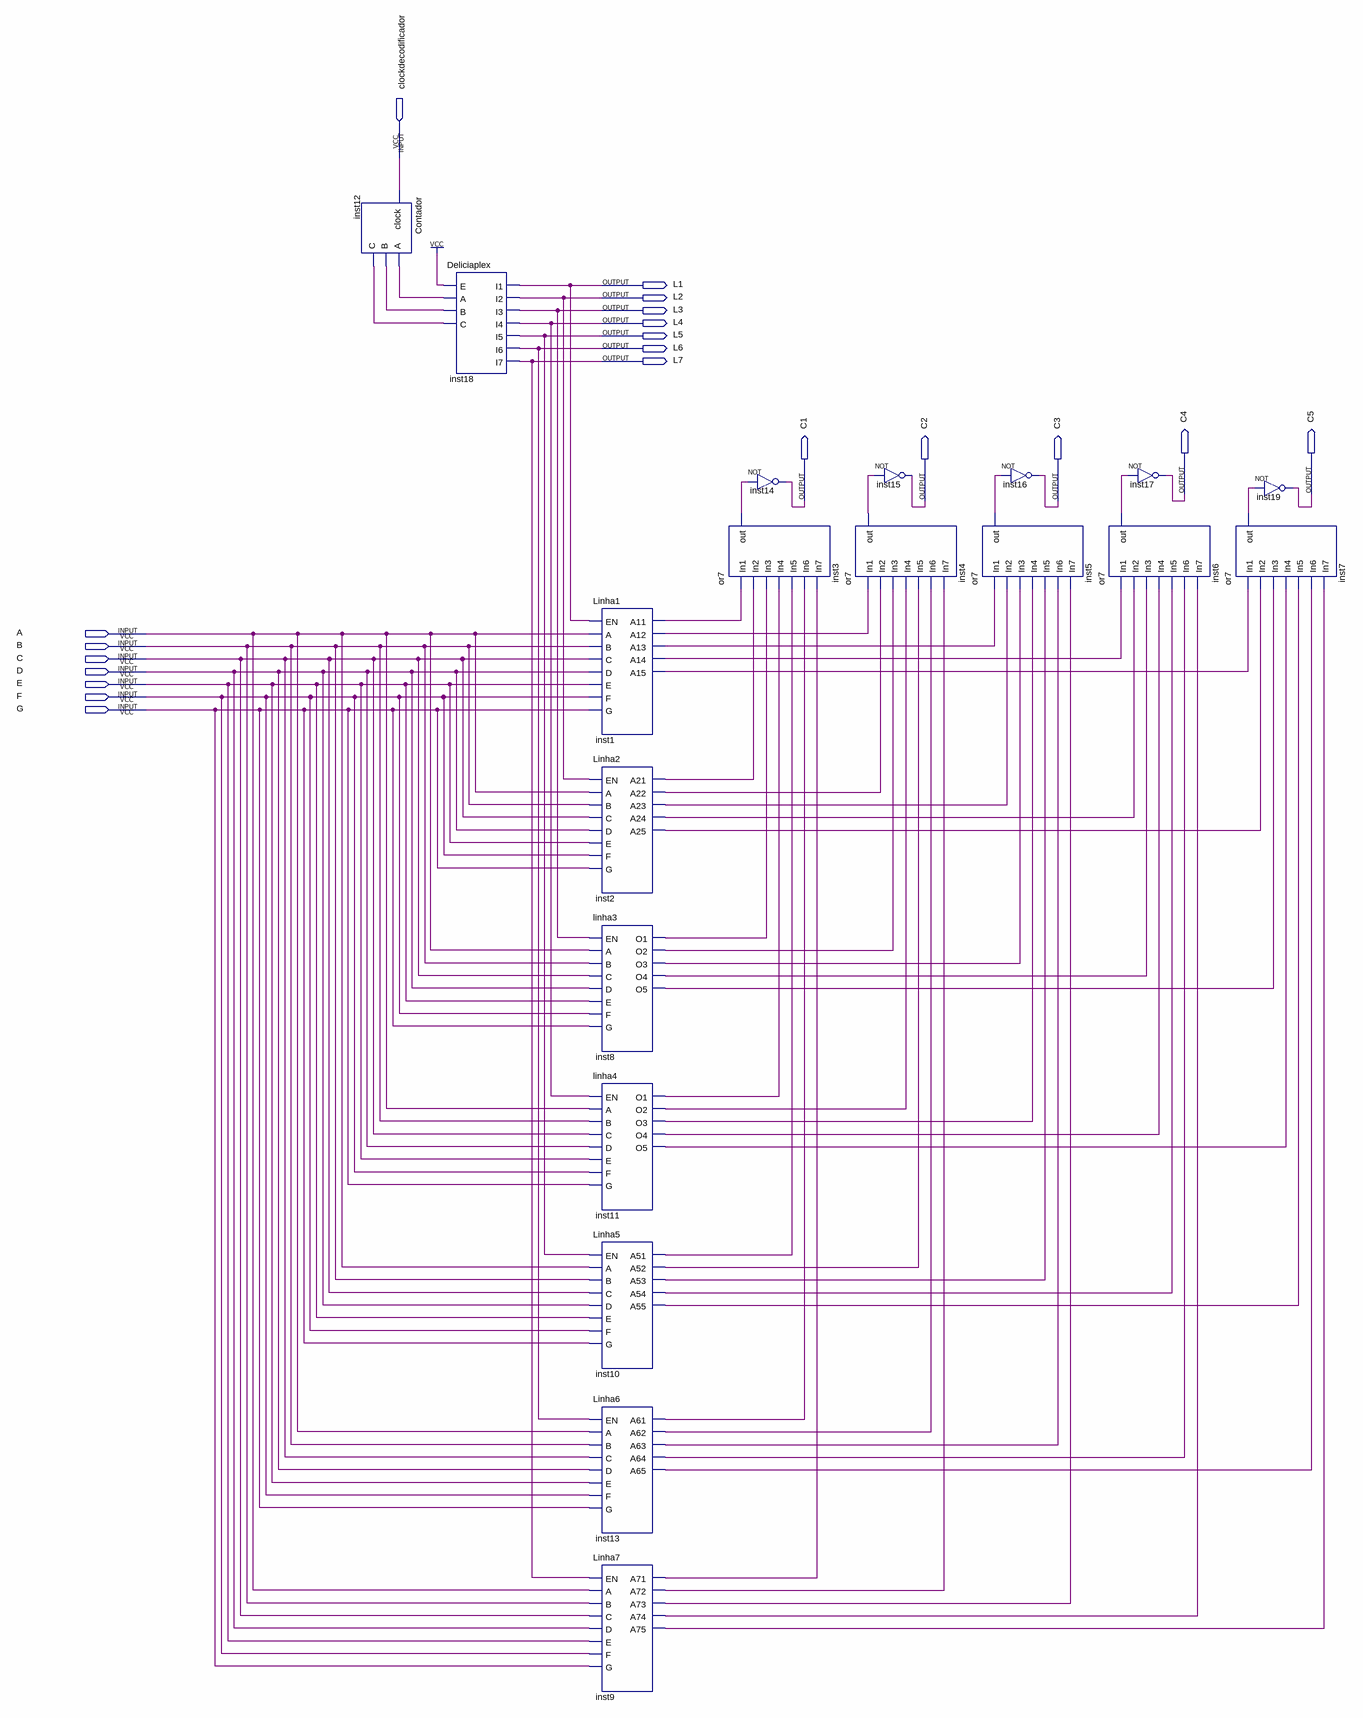
[diagram p0: schematic sheet]
// Quartus schematic DecodificadorMatriz.bdf as structural Verilog: 19 symbols, 20 pins
module DecodificadorMatriz (
  input  clockdecodificador,
  input  A,
  input  B,
  input  C,
  input  D,
  input  E,
  input  F,
  input  G,
  output L1,
  output L2,
  output L3,
  output L4,
  output L5,
  output L6,
  output L7,
  output C4,
  output C5,
  output C1,
  output C2,
  output C3
);

  wire inst1_a11, inst1_a12, inst1_a13, inst1_a14, inst1_a15, inst2_a21, inst2_a22, inst2_a23, inst2_a24,
       inst2_a25, inst3_out, inst4_out, inst5_out, inst6_out, inst7_out, inst8_o1, inst8_o2, inst8_o3,
       inst8_o4, inst8_o5, inst9_a71, inst9_a72, inst9_a73, inst9_a74, inst9_a75, inst10_a51, inst10_a52,
       inst10_a53, inst10_a54, inst10_a55, inst11_o1, inst11_o2, inst11_o3, inst11_o4, inst11_o5, inst12_a,
       inst12_b, inst12_c, inst13_a61, inst13_a62, inst13_a63, inst13_a64, inst13_a65;

  Contador inst12 (.clock(clockdecodificador), .A(inst12_a), .B(inst12_b), .C(inst12_c));
  Deliciaplex inst18 (
    .E(1'b1), .A(inst12_a), .B(inst12_b), .C(inst12_c), .I1(L1), .I2(L2), .I3(L3), .I4(L4), .I5(L5), .I6(L6),
    .I7(L7));
  Linha1 inst1 (
    .EN(L1), .A(A), .B(B), .C(C), .D(D), .E(E), .F(F), .G(G), .A11(inst1_a11), .A12(inst1_a12),
    .A13(inst1_a13), .A14(inst1_a14), .A15(inst1_a15));
  Linha2 inst2 (
    .EN(L2), .A(A), .B(B), .C(C), .D(D), .E(E), .F(F), .G(G), .A21(inst2_a21), .A22(inst2_a22),
    .A23(inst2_a23), .A24(inst2_a24), .A25(inst2_a25));
  linha3 inst8 (
    .EN(L3), .A(A), .B(B), .C(C), .D(D), .E(E), .F(F), .G(G), .O1(inst8_o1), .O2(inst8_o2), .O3(inst8_o3),
    .O4(inst8_o4), .O5(inst8_o5));
  linha4 inst11 (
    .EN(L4), .A(A), .B(B), .C(C), .D(D), .E(E), .F(F), .G(G), .O1(inst11_o1), .O2(inst11_o2), .O3(inst11_o3),
    .O4(inst11_o4), .O5(inst11_o5));
  Linha5 inst10 (
    .EN(L5), .A(A), .B(B), .C(C), .D(D), .E(E), .F(F), .G(G), .A51(inst10_a51), .A52(inst10_a52),
    .A53(inst10_a53), .A54(inst10_a54), .A55(inst10_a55));
  Linha6 inst13 (
    .EN(L6), .A(A), .B(B), .C(C), .D(D), .E(E), .F(F), .G(G), .A61(inst13_a61), .A62(inst13_a62),
    .A63(inst13_a63), .A64(inst13_a64), .A65(inst13_a65));
  Linha7 inst9 (
    .EN(L7), .A(A), .B(B), .C(C), .D(D), .E(E), .F(F), .G(G), .A71(inst9_a71), .A72(inst9_a72),
    .A73(inst9_a73), .A74(inst9_a74), .A75(inst9_a75));
  or inst3 (inst3_out, inst1_a11, inst2_a21, inst8_o1, inst11_o1, inst10_a51, inst13_a61, inst9_a71);
  not inst14 (C1, inst3_out);
  not inst15 (C2, inst4_out);
  or inst4 (inst4_out, inst1_a12, inst2_a22, inst8_o2, inst11_o2, inst10_a52, inst13_a62, inst9_a72);
  or inst5 (inst5_out, inst1_a13, inst2_a23, inst8_o3, inst11_o3, inst10_a53, inst13_a63, inst9_a73);
  not inst16 (C3, inst5_out);
  not inst17 (C4, inst6_out);
  or inst6 (inst6_out, inst1_a14, inst2_a24, inst8_o4, inst11_o4, inst10_a54, inst13_a64, inst9_a74);
  or inst7 (inst7_out, inst1_a15, inst2_a25, inst8_o5, inst11_o5, inst10_a55, inst13_a65, inst9_a75);
  not inst19 (C5, inst7_out);
endmodule
